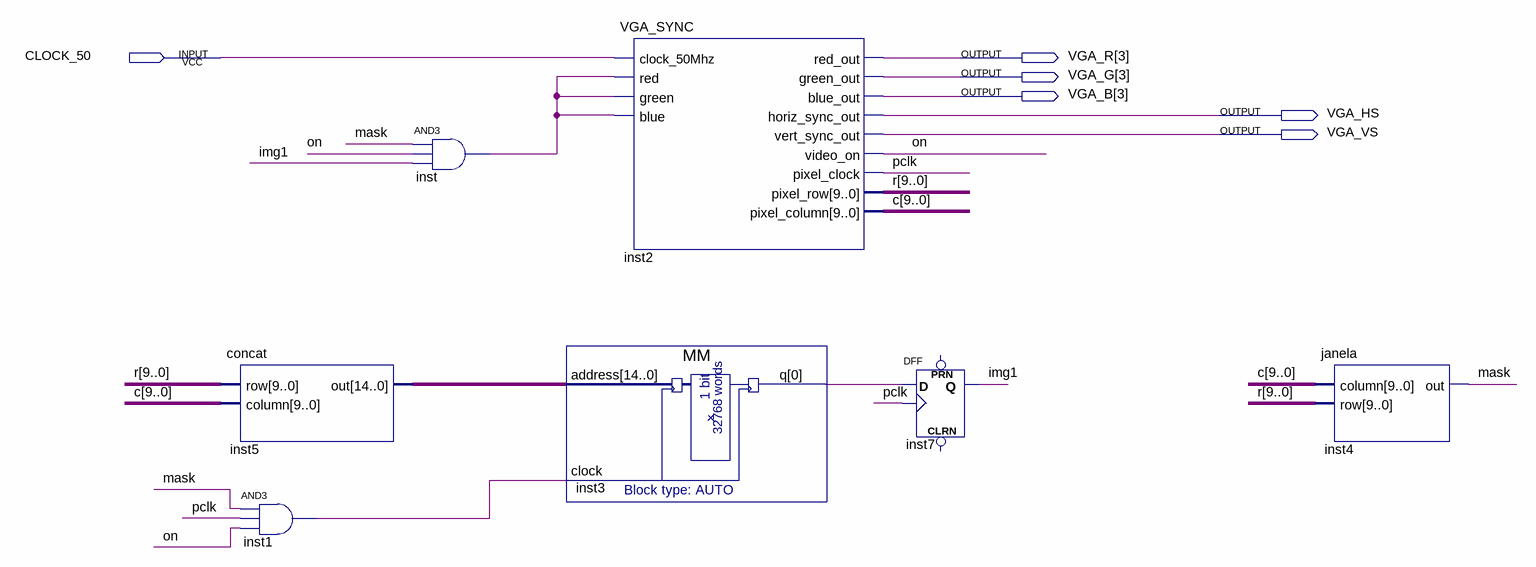
[diagram p0: schematic sheet]
// Quartus schematic lab3.bdf as structural Verilog: 7 symbols, 6 pins
module lab3 (
  input  CLOCK_50,
  output [3:3] VGA_R,
  output [3:3] VGA_G,
  output [3:3] VGA_B,
  output VGA_HS,
  output VGA_VS
);

  wire img1, inst1_out, inst3_q, inst_out, mask, on, pclk;
  wire [9:0] c, r;
  wire [14:0] inst5_out;

  concat inst5 (.row(r), .column(c), .out(inst5_out));
  and inst1 (inst1_out, mask, pclk, on);
  and inst (inst_out, mask, on, img1);
  MM inst3 (.address(inst5_out), .clock(inst1_out), .q(inst3_q));
  VGA_SYNC inst2 (
    .clock_50Mhz(CLOCK_50), .red(inst_out), .green(inst_out), .blue(inst_out), .red_out(VGA_R[3]),
    .green_out(VGA_G[3]), .blue_out(VGA_B[3]), .horiz_sync_out(VGA_HS), .vert_sync_out(VGA_VS),
    .video_on(on), .pixel_clock(pclk), .pixel_row(r), .pixel_column(c));
  DFF inst7 (.CLK(pclk), .D(inst3_q), .Q(img1));  // open: CLRN, PRN
  janela inst4 (.column(c), .row(r), .out(mask));
endmodule
